# EAGLE design GTwoShield (EAGLE 7.5.0)
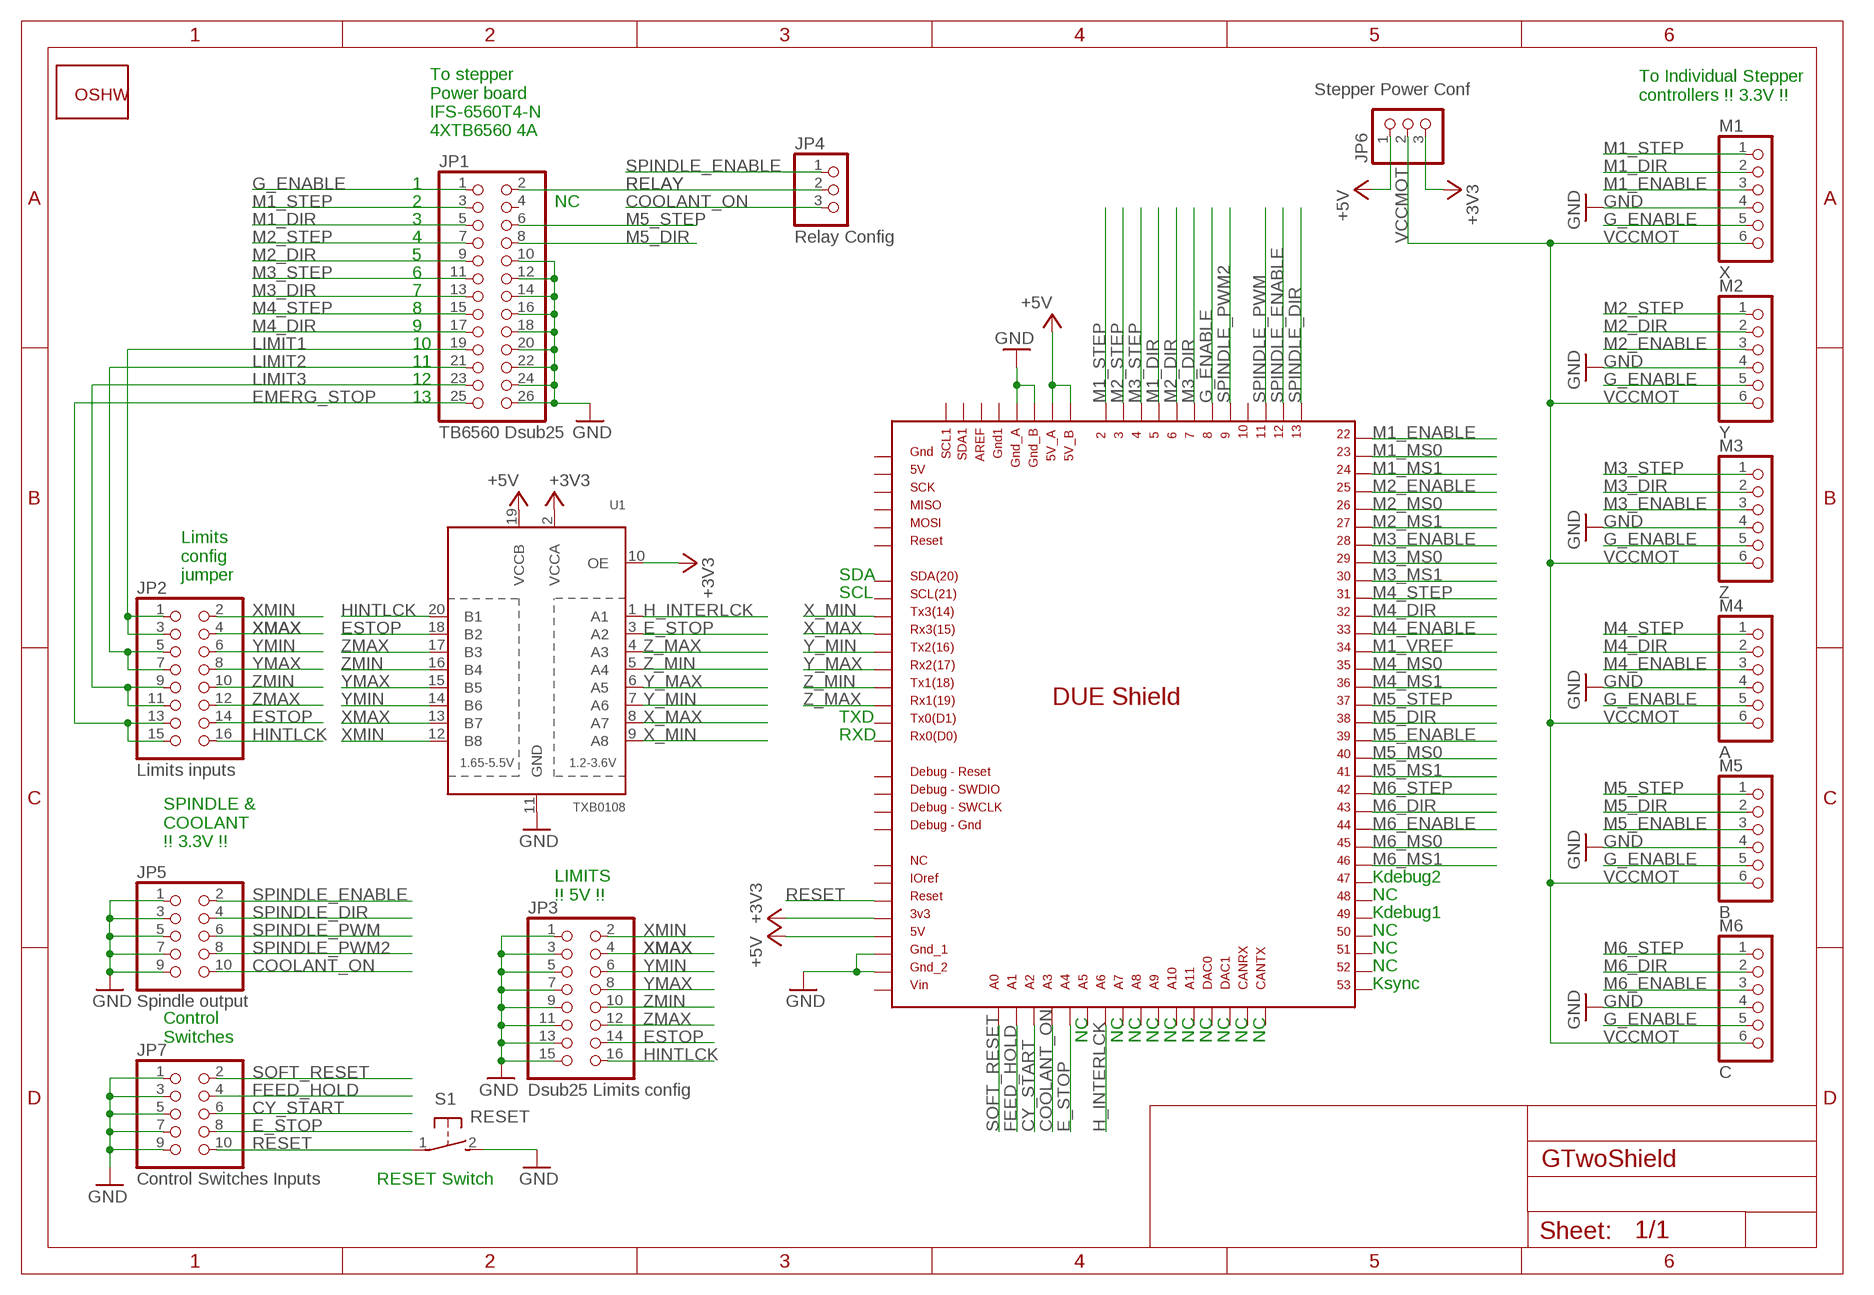
[diagram p0: schematic, sheet 1]

## Parts
GOLD_ORB_SM1  OSHWLOGO_GOLD_ORB_MED  [OSHW1]
JP1  TB6560 Dsub25  PINHD-2X13  [2X13]
JP2  Limits inputs  PINHD-2X8  [2X08]
JP3  Dsub25 Limits config  PINHD-2X8  [2X08]
JP4  Relay Config  PINHD-1X3  [1X03]
JP5  Spindle output  PINHD-2X5  [2X05]
JP6  Stepper Power Conf  PINHD-1X3  [1X03]
JP7  Control Switches Inputs  PINHD-2X5  [2X05]
M1  X  PINHD-1X6  [1X06]
M2  Y  PINHD-1X6  [1X06]
M3  Z  PINHD-1X6  [1X06]
M4  A  PINHD-1X6  [1X06]
M5  B  PINHD-1X6  [1X06]
M6  C  PINHD-1X6  [1X06]
S1  RESET  31-XX  [B3F-31XX]
U1  TXB0108  TXB0108PWR  [TSSOP20]
U$1  DUE(NORMAL)  [DUE(NORMAL)]

## Nets
+3V3: JP6.3 U1.2(VCCA) U1.10(OE) U$1.3V3
+5V: JP6.1 U1.19(VCCB) U$1.5V U$1.5V_A U$1.5V_B
COOLANT_ON: JP4.3 JP5.10 U$1.A3
CY_START: JP7.6 U$1.A2
E_STOP: JP7.8 U1.3(A2) U$1.A4
EMERG_STOP: JP1.25 JP2.13 JP2.15
ESTOP: JP2.14 JP3.14 U1.18(B2)
FEED_HOLD: JP7.4 U$1.A1
G_ENABLE: JP1.1 M1.5 M2.5 M3.5 M4.5 M5.5 M6.5 U$1.8
GND: JP1.10 JP1.12 JP1.14 JP1.16 JP1.18 JP1.20 JP1.22 JP1.24 JP1.26 JP3.1 JP3.3 JP3.5 JP3.7 JP3.9 JP3.11 JP3.13 JP3.15 JP5.1 JP5.3 JP5.5 JP5.7 JP5.9 JP7.1 JP7.3 JP7.5 JP7.7 JP7.9 M1.4 M2.4 M3.4 M4.4 M5.4 M6.4 S1.2(S) U1.11(GND) U$1.GND_1 U$1.GND_2 U$1.GND_A U$1.GND_B
H_INTERLCK: U1.1(A1) U$1.A6
HINTLCK: JP2.16 JP3.16 U1.20(B1)
LIMIT1: JP1.19 JP2.1 JP2.3
LIMIT2: JP1.21 JP2.5 JP2.7
LIMIT3: JP1.23 JP2.9 JP2.11
M1_DIR: JP1.5 M1.2 U$1.5
M1_ENABLE: M1.3 U$1.22
M1_MS0: U$1.23
M1_MS1: U$1.24
M1_STEP: JP1.3 M1.1 U$1.2
M1_VREF: U$1.34
M2_DIR: JP1.9 M2.2 U$1.6
M2_ENABLE: M2.3 U$1.25
M2_MS0: U$1.26
M2_MS1: U$1.27
M2_STEP: JP1.7 M2.1 U$1.3
M3_DIR: JP1.13 M3.2 U$1.7
M3_ENABLE: M3.3 U$1.28
M3_MS0: U$1.29
M3_MS1: U$1.30
M3_STEP: JP1.11 M3.1 U$1.4
M4_DIR: JP1.17 M4.2 U$1.32
M4_ENABLE: M4.3 U$1.33
M4_MS0: U$1.35
M4_MS1: U$1.36
M4_STEP: JP1.15 M4.1 U$1.31
M5_DIR: JP1.8 M5.2 U$1.38
M5_ENABLE: M5.3 U$1.39
M5_MS0: U$1.40
M5_MS1: U$1.41
M5_STEP: JP1.6 M5.1 U$1.37
M6_DIR: M6.2 U$1.43
M6_ENABLE: M6.3 U$1.44
M6_MS0: U$1.45
M6_MS1: U$1.46
M6_STEP: M6.1 U$1.42
RELAY: JP1.2 JP4.2
RESET: JP7.10 S1.1(P) U$1.RESET
SOFT_RESET: JP7.2 U$1.A0
SPINDLE_DIR: JP5.4 U$1.13
SPINDLE_ENABLE: JP4.1 JP5.2 U$1.12
SPINDLE_PWM: JP5.6 U$1.11
SPINDLE_PWM2: JP5.8 U$1.9
VCCMOT: JP6.2 M1.6 M2.6 M3.6 M4.6 M5.6 M6.6
X_MAX: U1.8(A7) U$1.RX3
X_MIN: U1.9(A8) U$1.TX3
XMAX: JP2.4 JP3.4 U1.13(B7)
XMIN: JP2.2 JP3.2 U1.12(B8)
Y_MAX: U1.6(A5) U$1.RX2
Y_MIN: U1.7(A6) U$1.TX2
YMAX: JP2.8 JP3.8 U1.15(B5)
YMIN: JP2.6 JP3.6 U1.14(B6)
Z_MAX: U1.4(A3) U$1.RX1
Z_MIN: U1.5(A4) U$1.TX1
ZMAX: JP2.12 JP3.12 U1.17(B3)
ZMIN: JP2.10 JP3.10 U1.16(B4)
Unconnected: JP1.4 U$1.5V_ICSP U$1.10 U$1.47 U$1.48 U$1.49 U$1.50 U$1.51 U$1.52 U$1.53 U$1.A5 U$1.A7 U$1.A8 U$1.A9 U$1.A10 U$1.A11 U$1.AREF U$1.CANRX U$1.CANTX U$1.DAC0 U$1.DAC1 U$1.GND1 U$1.GND_DEBUG U$1.GND_ICSP U$1.IOREF U$1.MISO_ICSP U$1.MOSI_ICSP U$1.NC U$1.RESET_DEBUG U$1.RESET_ICSP U$1.RX0 U$1.SCK_ICSP U$1.SCL U$1.SCL1 U$1.SDA U$1.SDA1 U$1.SWCLK_DEBUG U$1.SWDIO_DEBUG U$1.TX0 U$1.VIN

## Notes on the sheet
- To Individual Stepper 
  controllers !! 3.3V !!
- To stepper
  Power board 
  IFS-6560T4-N 
  4XTB6560 4A
- 1
- 2 | NC
- 3
- 4
- 5
- 6
- 7
- 8
- 9
- 10
- 11
- 12
- 13
- Limits 
  config 
  jumper
- SDA
- SCL
- TXD
- RXD
- SPINDLE &
  COOLANT
  !! 3.3V !!
- Kdebug2
- LIMITS 
  !! 5V !!
- NC
- Kdebug1
- NC
- NC
- NC
- Ksync
- Control 
  Switches
- NC | NC | NC | NC | NC | NC | NC | NC | NC | NC
- RESET Switch

## Library data of the parts
GOLD_ORB_SM1 = NBitWonder:OSHWLOGO: These are Open-Source Hardware logos.
JP1 = pinhead:PINHD-2X13: PIN HEADER
JP2 JP3 = pinhead:PINHD-2X8: PIN HEADER
JP4 JP6 = pinhead:PINHD-1X3: PIN HEADER
JP5 JP7 = pinhead:PINHD-2X5: PIN HEADER
M1-M6 = pinhead:PINHD-1X6: PIN HEADER
S1 = adafruit:31-XX: OMRON SWITCH Now with beefier pads!
U1 = adafruit:TXB0108PWR: 8-Bit Bi-Directional Level Shifter 1.2V-3.6V (VCCA) to 1.65V-5.5V (VCCB) bi-directional level shifter with auto direction sensing. Max data rate - VCCA 1.8V: 20Mbps (50ns), VCCA 3.3V: 100Mbps (10ns) Digikey: 296-21527-1-ND
U$1 = DUElib130425:DUE(NORMAL)

## Board
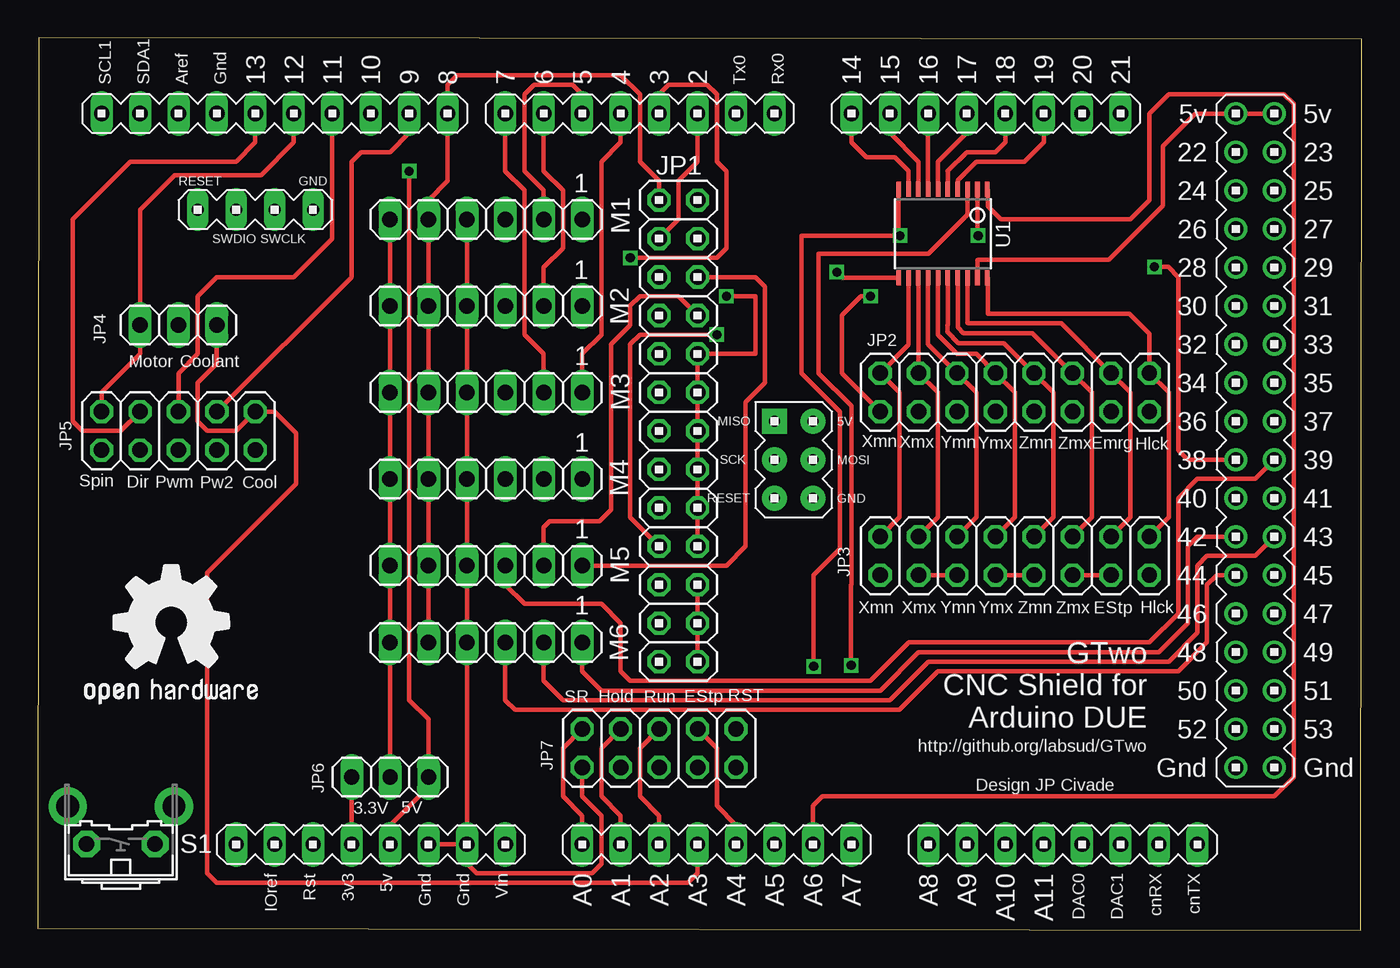
[diagram p1: board, top side]
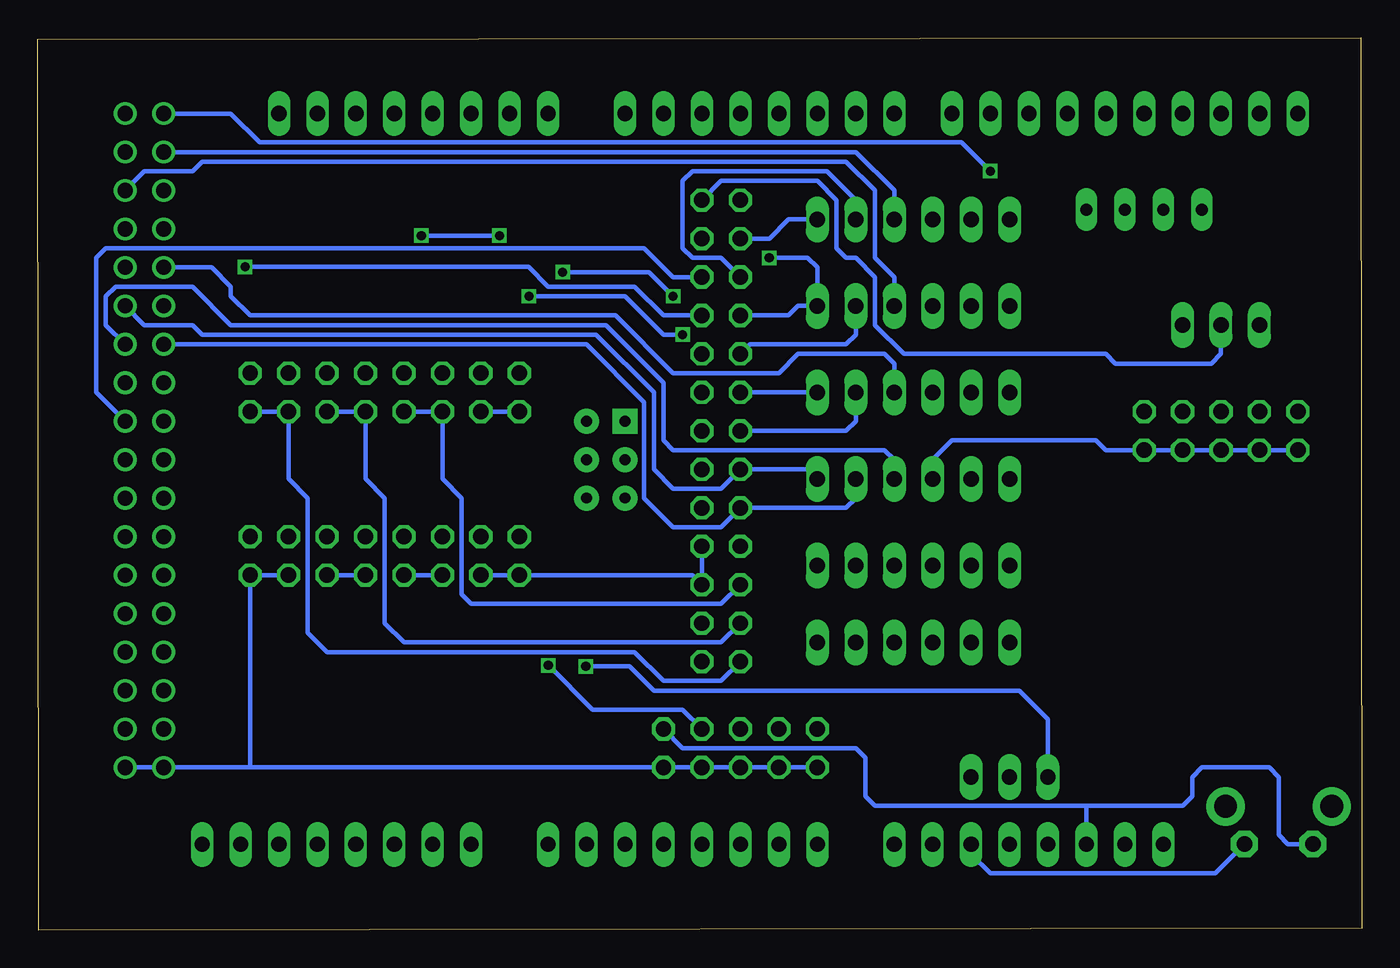
[diagram p2: board, bottom side, seen from below]

Size 87.45 x 58.92 mm. Coordinates in mm from the lower left corner, seen from the top.
Outline: 0,0.11 87.4,0 87.45,58.81 0.04,58.92 0,0.11
Copper layers (1*16): Top 0.035mm / dielectric 1.5mm / Bottom 0.035mm
Design rules "JPC-SparkFun-2-layer-TIGHT": minimum track width 7mil, minimum drill 15mil, track to track 7mil, track to pad 7mil, pad to pad 7mil, via to via 7mil, smd to smd 7mil, copper to edge 7mil, drill to drill 7mil, minimum pad ring 7mil, minimum via ring 7mil, stop-mask expansion 4mil, vias tented up to drill 25mil, thermal gap 10mil

### Footprints (pad centres in the part's own frame; a part is rotated, then mirrored left to right if it is on the bottom)
2X13 = drill 1.016 octagon: 1 -15.24,-1.27; 2 -15.24,1.27; 3 -12.7,-1.27; 4 -12.7,1.27; 5 -10.16,-1.27; 6 -10.16,1.27; 7 -7.62,-1.27; 8 -7.62,1.27; 9 -5.08,-1.27; 10 -5.08,1.27; 11 -2.54,-1.27; 12 -2.54,1.27; 13 0,-1.27; 14 0,1.27; 15 2.54,-1.27; 16 2.54,1.27; 17 5.08,-1.27; 18 5.08,1.27; 19 7.62,-1.27; 20 7.62,1.27; 21 10.16,-1.27; 22 10.16,1.27; 23 12.7,-1.27; 24 12.7,1.27; 25 15.24,-1.27; 26 15.24,1.27
2X08 = drill 1.016 octagon: 1 -8.89,-1.27; 2 -8.89,1.27; 3 -6.35,-1.27; 4 -6.35,1.27; 5 -3.81,-1.27; 6 -3.81,1.27; 7 -1.27,-1.27; 8 -1.27,1.27; 9 1.27,-1.27; 10 1.27,1.27; 11 3.81,-1.27; 12 3.81,1.27; 13 6.35,-1.27; 14 6.35,1.27; 15 8.89,-1.27; 16 8.89,1.27
1X03 = drill 1.016 long: 1 -2.54,0; 2 0,0; 3 2.54,0
2X05 = drill 1.016 octagon: 1 -5.08,-1.27; 2 -5.08,1.27; 3 -2.54,-1.27; 4 -2.54,1.27; 5 0,-1.27; 6 0,1.27; 7 2.54,-1.27; 8 2.54,1.27; 9 5.08,-1.27; 10 5.08,1.27
1X06 = drill 1.016 long: 1 -6.35,0; 2 -3.81,0; 3 -1.27,0; 4 1.27,0; 5 3.81,0; 6 6.35,0
B3F-31XX = drill 1.016 pad 1.778 octagon: 1 -2.261,-1.245; 2 2.261,-1.245 | drill 1.499 pad 2.54: 3 -3.505,1.245; 4 3.505,1.245
TSSOP20 = smd 0.305 x 0.991: 1 -2.925,-2.918; 2 -2.275,-2.918; 3 -1.625,-2.918; 4 -0.975,-2.918; 5 -0.325,-2.918; 6 0.325,-2.918; 7 0.975,-2.918; 8 1.625,-2.918; 9 2.275,-2.918; 10 2.925,-2.918; 11 2.925,2.918; 12 2.275,2.918; 13 1.625,2.918; 14 0.975,2.918; 15 0.325,2.918; 16 -0.325,2.918; 17 -0.975,2.918; 18 -1.625,2.918; 19 -2.275,2.918; 20 -2.925,2.918
DUE(NORMAL) = drill 1 long: 2 -16.51,30.48; 3 -19.05,30.48; 3V3 -39.37,-17.78; 4 -21.59,30.48; 5 -24.13,30.48; 5V -36.83,-17.78; 6 -26.67,30.48; 7 -29.21,30.48; 8 -33.02,30.48; 9 -35.56,30.48; 10 -38.1,30.48; 11 -40.64,30.48; 12 -43.18,30.48; 13 -45.72,30.48; A0 -24.13,-17.78; A1 -21.59,-17.78; A2 -19.05,-17.78; A3 -16.51,-17.78; A4 -13.97,-17.78; A5 -11.43,-17.78; A6 -8.89,-17.78; A7 -6.35,-17.78; A8 -1.27,-17.78; A9 1.27,-17.78; A10 3.81,-17.78; A11 6.35,-17.78; AREF -50.8,30.48; CANRX 13.97,-17.78; CANTX 16.51,-17.78; DAC0 8.89,-17.78; DAC1 11.43,-17.78; GND1 -48.26,30.48; GND_1 -34.29,-17.78; GND_2 -31.75,-17.78; IOREF -44.45,-17.78; NC -46.99,-17.78; RESET -41.91,-17.78; RX0 -11.43,30.48; RX1 6.35,30.48; RX2 1.27,30.48; RX3 -3.81,30.48; SCL 11.43,30.48; SCL1 -55.88,30.48; SDA 8.89,30.48; SDA1 -53.34,30.48; TX0 -13.97,30.48; TX1 3.81,30.48; TX2 -1.27,30.48; TX3 -6.35,30.48; VIN -29.21,-17.78 | drill 1: 5V_A 19.05,30.48; 5V_B 21.59,30.48; 22 19.05,27.94; 23 21.59,27.94; 24 19.05,25.4; 25 21.59,25.4; 26 19.05,22.86; 27 21.59,22.86; 28 19.05,20.32; 29 21.59,20.32; 30 19.05,17.78; 31 21.59,17.78; 32 19.05,15.24; 33 21.59,15.24; 34 19.05,12.7; 35 21.59,12.7; 36 19.05,10.16; 37 21.59,10.16; 38 19.05,7.62; 39 21.59,7.62; 40 19.05,5.08; 41 21.59,5.08; 42 19.05,2.54; 43 21.59,2.54; 44 19.05,0; 45 21.59,0; 46 19.05,-2.54; 47 21.59,-2.54; 48 19.05,-5.08; 49 21.59,-5.08; 50 19.05,-7.62; 51 21.59,-7.62; 52 19.05,-10.16; 53 21.59,-10.16; GND_A 19.05,-12.7; GND_B 21.59,-12.7 | drill 0.7 pad 1.676: 5V_ICSP -8.89,5.08; GND_ICSP -8.89,10.16; MOSI_ICSP -8.89,7.62; RESET_ICSP -11.43,5.08; SCK_ICSP -11.43,7.62 | drill 0.8 pad 1.422 long: GND_DEBUG -41.91,24.13; RESET_DEBUG -49.53,24.13; SWCLK_DEBUG -44.45,24.13; SWDIO_DEBUG -46.99,24.13 | drill 0.7 pad 1.676 square: MISO_ICSP -11.43,10.16

### Placement (x,y rotation side)
GOLD_ORB_SM1  2.44,13.18 0 top
JP1  42.31,32.96 270 top
JP2  64.53,35.5 0 top
JP3  64.53,24.71 0 top
JP4  9.29,39.95 0 top
JP5  9.29,32.96 0 top
JP6  23.27,10.1 180 top
JP7  41.04,12.01 0 top
M1  29.61,46.93 180 top
M2  29.61,41.22 180 top
M3  29.61,35.5 180 top
M4  29.61,29.79 180 top
M5  29.61,24.07 180 top
M6  29.61,18.99 180 top
S1  5.48,6.93 0 top
U1  59.79,45.99 180 top
U$1  60.09,23.44 0 top

### Tracks (layer width: path | path; a pad name or v marks a point on that pad's centre or on a via)
+3V3  (via drill 0.6)
  Top 0.305: JP6.3 U$1.3V3 | v51.25,17.41 51.25,23.44 52.98,25.17 52.98,34.23 50.44,36.77 50.44,45.86 v56.95,45.86 56.86,45.95 U1.10 | v62.11,45.86 62.06,45.91 U1.2
  Bottom 0.305: v62.11,45.86 v56.95,45.86 | v51.25,17.41 48.35,17.41 46.75,15.82 22.62,15.82 20.73,13.92 JP6.3
+5V  (via drill 0.6)
  Top 0.305: U$1.5V_B U$1.5V_A 76.47,53.92 74.31,51.76 74.31,47.82 70.74,44.25 62.11,44.25 62.06,44.2 U1.19 62.11,43.12 | U$1.5V 23.26,6.93 25.81,9.48 JP6.1 25.8,10.11 25.8,13.91 24.53,15.18 v24.53,50.11
  Bottom 0.305: v24.53,50.11 26.43,52.01 72.79,52.01 74.69,53.92 U$1.5V_A
COOLANT_ON
  Top 0.305: JP4.3 11.83,37.41 10.56,36.14 10.56,33.6 11.19,32.96 13.1,32.96 JP5.10 15.64,34.23 17.07,32.8 17.07,29.47 11.19,23.6 11.19,3.75 11.83,3.12 42.94,3.12 43.58,3.75 U$1.A3
CY_START
  Top 0.305: JP7.6 39.77,12.01 39.77,8.83 41.04,7.56 U$1.A2
E_STOP  (via drill 0.6)
  Top 0.305: U$1.A4 46.12,6.93 44.85,8.2 44.85,12.01 JP7.8 | v53.73,17.47 53.73,22.79 53.74,22.8 53.74,34.61 51.58,36.77 51.58,44.65 58.82,44.65 61.41,47.24 U1.3
  Bottom 0.305: v53.73,17.47 50.8,14.55 44.85,14.55 JP7.8
EMERG_STOP
  Bottom 0.305: JP2.15 JP2.13 70.88,29.79 69.61,28.52 69.61,19.63 68.34,18.36 48.02,18.36 46.12,16.45 42.31,16.45 JP1.25
ESTOP
  Top 0.305: U1.18 61.41,40.11 61.47,40.06 67.6,40.06 JP2.14 72.15,35.5 72.15,27.25 JP3.14
FEED_HOLD
  Top 0.305: JP7.4 37.23,12.01 37.23,8.83 38.5,7.56 U$1.A1
G_ENABLE
  Top 0.305: M6.5 M5.5 M4.5 M3.5 M2.5 M1.5 25.8,48.2 27.07,49.47 U$1.8 27.07,55.82 27.7,56.46 38.5,56.46 39.77,55.19 39.77,50.74 41.04,49.47 JP1.1
GND  (via drill 0.6)
  Top 0.305: M1.4 M2.4 M3.4 M4.4 | 28.34,29.15 M4.4 | M4.4 M5.4 M6.4 U$1.GND_2 | JP3.13 JP3.11 | JP3.9 JP3.7 | JP3.5 JP3.3 | U$1.GND_2 U$1.GND_1 | JP1.26 JP1.24 JP1.22 | JP1.20 JP1.18 JP1.16 JP1.14 JP1.12 JP1.10 47.39,38.04 47.39,41.85 v45.48,41.85 | JP7.1 35.96,8.83 37.23,7.56 37.23,4.39 36.59,3.75 28.97,3.75 28.34,4.39 U$1.GND_2 | v52.78,43.45 53.16,43.07 U1.11
  Bottom 0.305: JP5.1 JP5.3 JP5.5 JP5.7 JP5.9 16.91,31.69 17.54,32.33 27.07,32.33 28.34,31.06 M4.4 | JP3.13 JP3.15 73.42,10.74 | JP3.11 JP3.9 | JP3.7 JP3.5 | JP3.3 JP3.1 44.21,23.44 JP1.22 JP1.20 | U$1.GND_B U$1.GND_A 73.42,10.74 | JP7.1 JP7.3 JP7.5 JP7.7 | JP7.7 JP7.9 | S1.2 9.67,3.75 24.53,3.75 25.8,5.02 U$1.GND_1 | JP7.7 73.42,10.74 | v45.48,41.85 47.08,43.45 v52.78,43.45
H_INTERLCK
  Top 0.305: U1.1 62.76,48.86 62.76,47.8 63.62,46.93 72.15,46.93 73.42,48.2 73.42,53.92 74.69,55.19 82.31,55.19 82.95,54.55 82.95,10.1 81.68,8.83 51.83,8.83 51.2,8.2 U$1.A6
HINTLCK
  Top 0.305: JP3.16 74.69,27.25 74.69,35.5 JP2.16 73.42,39.39 72.11,40.7 62.76,40.7 62.76,43.02 U1.20
LIMIT1  (via drill 0.6)
  Top 0.305: JP1.19 39.13,27.25 39.13,38.68 39.77,39.31 v44.85,39.31 | JP2.1 53.1,36.77 53.1,40.58 54.37,41.85 v55.01,41.85
  Bottom 0.305: JP2.3 JP2.1 | v44.85,39.31 46.12,39.31 48.66,41.85 v55.01,41.85
LIMIT2
  Bottom 0.305: JP2.7 JP2.5 60.72,29.79 59.45,28.52 59.45,22.17 58.82,21.53 42.31,21.53 JP1.21
LIMIT3
  Bottom 0.305: JP2.11 JP2.9 65.8,29.79 64.53,28.52 64.53,20.26 63.26,18.99 42.31,18.99 JP1.23
M1_DIR
  Top 0.305: M1.2 33.42,48.84 32.15,50.11 32.15,55.19 32.78,55.82 35.32,55.82 35.96,55.19 U$1.5
  Bottom 0.305: M1.2 33.42,48.2 35.32,50.11 44.21,50.11 44.85,49.47 44.85,45.03 44.21,44.39 42.31,44.39 JP1.5
M1_ENABLE
  Bottom 0.305: M1.3 30.88,48.84 33.42,51.38 U$1.22
M1_STEP
  Top 0.305: U$1.2 43.58,50.74 42.31,49.47 42.31,46.93 JP1.3
  Bottom 0.305: M1.1 37.86,46.93 39.13,45.66 JP1.3
M2_DIR
  Top 0.305: U$1.6 33.42,50.11 34.69,48.84 34.69,45.03 33.42,43.76 M2.2
  Bottom 0.305: M2.2 33.42,39.31 34.05,38.68 40.4,38.68 JP1.9
M2_ENABLE
  Bottom 0.305: M2.3 30.88,43.12 32.15,44.39 32.15,48.84 34.05,50.74 76.6,50.74 77.23,50.11 80.41,50.11 U$1.25
M2_STEP  (via drill 0.6)
  Top 0.305: U$1.3 41.04,55.19 41.67,55.82 44.21,55.82 44.85,55.19 44.85,50.74 45.48,50.11 45.48,45.03 44.85,44.39 v39.13,44.39
  Bottom 0.305: JP1.7 37.86,40.58 37.23,41.22 M2.1 35.96,43.76 36.59,44.39 v39.13,44.39
M3_DIR
  Top 0.305: U$1.7 30.88,50.11 32.15,48.84 32.15,39.31 33.42,38.04 M3.2
  Bottom 0.305: JP1.13 34.05,32.96 33.42,33.6 M3.2
M3_ENABLE
  Bottom 0.305: M3.3 30.88,37.41 31.51,38.04 37.23,38.04 38.5,36.77 45.48,36.77 49.29,40.58 73.42,40.58 74.69,41.85 74.69,42.49 75.96,43.76 U$1.28
M3_STEP
  Top 0.305: M3.1 35.96,38.04 37.23,39.31 37.23,50.74 38.5,52.01 U$1.4
  Bottom 0.305: JP1.11 M3.1
M4_DIR
  Bottom 0.305: M4.2 33.42,28.52 34.05,27.88 JP1.17 42.31,26.61 45.48,26.61 47.39,28.52 47.39,34.87 51.2,38.68 U$1.32
M4_ENABLE
  Bottom 0.305: M4.3 30.88,31.06 31.51,31.69 45.48,31.69 46.12,32.33 46.12,36.14 49.93,39.95 74.69,39.95 77.23,42.49 82.31,42.49 82.95,41.85 82.95,39.95 U$1.33
M4_STEP
  Bottom 0.305: M4.1 36.59,30.42 JP1.15 42.31,29.15 45.48,29.15 46.75,30.42 46.75,35.5 50.56,39.31 76.6,39.31 77.23,39.95 80.41,39.95 U$1.31
M5_DIR  (via drill 0.6)
  Top 0.305: M5.2 33.42,26.61 33.8,27 37.1,27 37.86,27.76 37.86,38.68 39.13,39.95 39.13,41.22 39.77,41.85 42.31,41.85 JP1.8 | U$1.38 75.96,31.06 75.33,31.69 75.33,43.12 74.66,43.79 v73.76,43.79
  Bottom 0.305: JP1.8 46.12,40.58 48.02,42.49 53.74,42.49 55.04,43.79 v73.76,43.79
M5_ENABLE
  Top 0.305: U$1.39 80.41,29.79 76.6,29.79 75.33,28.52 75.33,20.9 73.42,18.99 57.55,18.99 55.01,16.45 39.13,16.45 38.5,17.09 38.5,20.26 37.23,21.53 32.15,21.53 30.88,22.8 M5.3
M5_STEP
  Top 0.305: M5.1 45.48,24.07 46.75,25.34 46.75,34.87 48.02,36.14 48.02,42.49 47.39,43.12 JP1.6
  Bottom 0.305: U$1.37 83.58,35.5 83.58,44.39 82.95,45.03 47.39,45.03 45.48,43.12 JP1.6
M6_DIR
  Top 0.305: U$1.43 80.41,24.71 77.23,24.71 76.6,24.07 76.6,19.63 74.69,17.72 58.82,17.72 56.28,15.18 34.69,15.18 33.42,16.45 M6.2
M6_ENABLE
  Top 0.305: U$1.44 77.87,23.44 77.23,22.8 77.23,18.99 75.33,17.09 59.45,17.09 56.91,14.55 31.51,14.55 30.88,15.18 M6.3
M6_STEP
  Top 0.305: U$1.42 76.6,25.98 75.96,25.34 75.96,20.26 74.06,18.36 58.18,18.36 55.64,15.82 37.23,15.82 35.96,17.09 M6.1
RELAY
  Bottom 0.305: JP1.2 42.31,49.47 35.96,49.47 34.69,48.2 34.69,45.03 34.05,44.39 33.42,44.39 32.15,43.12 32.15,39.95 30.24,38.04 16.91,38.04 16.27,37.41 9.92,37.41 9.29,38.04 JP4.2
RESET
  Bottom 0.305: U$1.RESET 18.18,8.2 | 18.18,8.2 32.15,8.2 32.78,8.83 32.78,11.37 33.42,12.01 44.85,12.01 JP7.10 | 18.18,8.2 11.83,8.2 11.19,8.83 11.19,10.1 10.56,10.74 6.11,10.74 5.48,10.1 5.48,6.29 4.87,5.68 S1.1
SOFT_RESET
  Top 0.305: JP7.2 34.69,12.01 34.69,8.83 35.96,7.56 U$1.A0
SPINDLE_DIR
  Top 0.305: JP5.4 5.48,32.96 2.94,32.96 2.3,33.6 2.3,46.93 6.11,50.74 13.1,50.74 14.37,52.01 U$1.13
SPINDLE_ENABLE
  Top 0.305: JP5.2 4.21,35.5 6.75,38.04 JP4.1 6.75,47.57 9.03,49.86 14.75,49.86 16.91,52.01 U$1.12
SPINDLE_PWM
  Top 0.305: JP5.6 9.29,36.77 10.56,38.04 10.56,41.85 11.83,43.12 16.91,43.12 19.45,45.66 U$1.11
SPINDLE_PWM2
  Top 0.305: JP5.8 20.72,43.12 20.72,50.74 21.35,51.38 23.26,51.38 24.53,52.65 U$1.9
VCCMOT
  Top 0.305: M1.6 M2.6 M3.6 M4.6 M5.6 M6.6 23.27,18.98 JP6.2
X_MAX
  Top 0.305: U1.8 58.16,50.09 58.18,50.11 58.18,50.74 56.28,52.65 U$1.RX3
X_MIN
  Top 0.305: U1.9 57.51,50.14 56.63,51.02 54.73,51.02 53.74,52.01 U$1.TX3
XMAX
  Top 0.305: U1.13 58.16,36.8 JP2.4 59.45,35.5 59.45,27.25 JP3.4
XMIN
  Top 0.305: JP3.2 56.91,27.25 56.91,35.5 JP2.2 57.51,38.64 U1.12
Y_MAX
  Top 0.305: U1.6 59.46,50.74 59.45,50.74 61.36,52.65 U$1.RX2
Y_MIN
  Top 0.305: U1.7 U$1.TX2
YMAX
  Top 0.305: U1.15 59.46,39.32 59.45,39.31 60.72,38.04 61.99,38.04 JP2.8 64.53,35.5 64.53,27.25 JP3.8
YMIN
  Top 0.305: U1.14 58.81,38.69 JP2.6 61.99,35.5 61.99,27.25 JP3.6
Z_MAX
  Top 0.305: U1.4 60.76,49.51 61.99,50.74 65.17,50.74 66.44,52.01 U$1.RX1
Z_MIN
  Top 0.305: U1.5 60.11,50.09 60.09,50.11 61.36,51.38 63.26,51.38 63.9,52.01 U$1.TX1
ZMAX
  Top 0.305: U1.17 60.76,39.79 61.14,39.41 65.71,39.41 JP2.12 69.61,35.5 69.61,27.25 JP3.12
ZMIN
  Top 0.305: U1.16 60.11,39.97 60.09,39.95 60.09,39.5 60.82,38.77 63.81,38.77 JP2.10 67.07,35.5 67.07,27.25 JP3.10

### Text on the board
tSilk: 1 | 1 | Motor | Coolant | 1 | 1 | Xmn | Xmx | Ymn | Ymx | Zmn | Zmx | Emrg | Hlck | Spin | Dir | Pwm | Pw2 | Cool | 1 | 1 | Xmn | Xmx | Ymn | Ymx | Zmn | Zmx | EStp | Hlck | SR | Hold | Run | EStp | RST | GTwo / CNC Shield for / Arduino DUE | http://github.org/labsud/GTwo | Design JP Civade | 3.3V | 5V